# EAGLE design PRE_amp_16_5 (EAGLE 9.0.0)
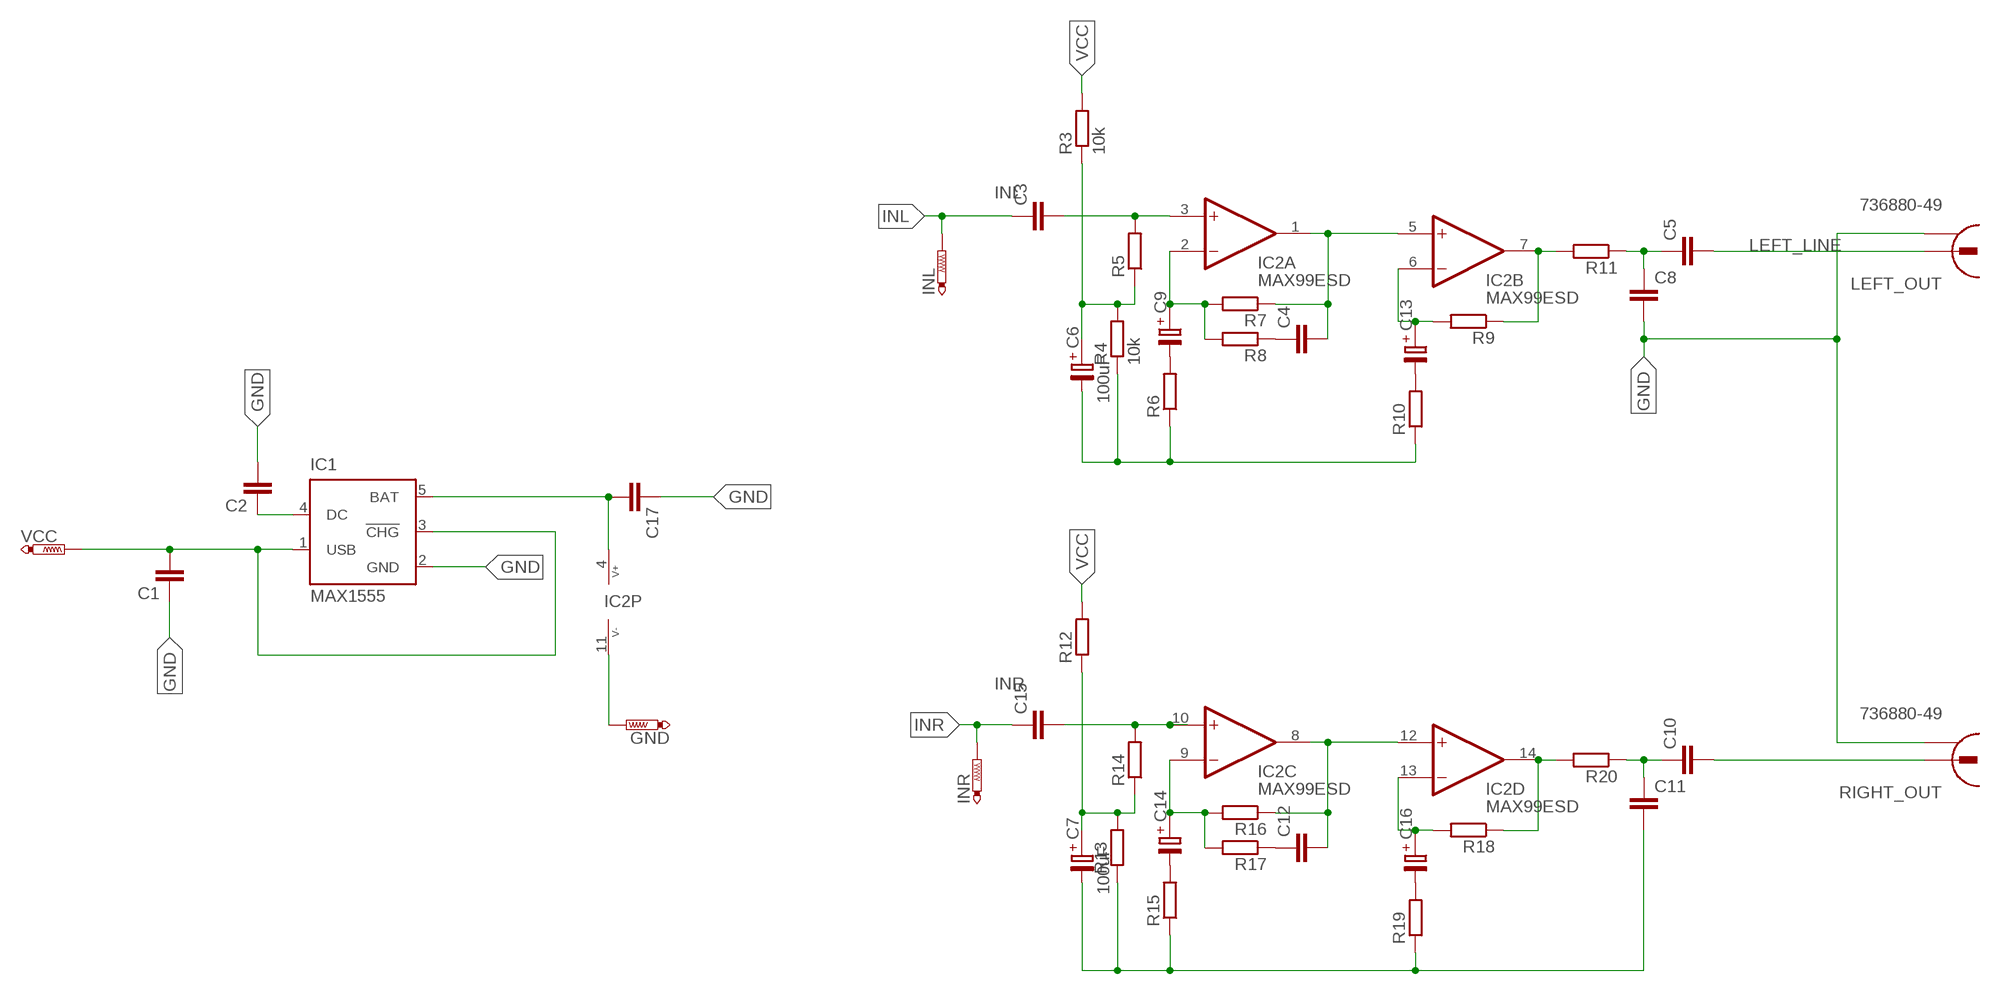
[diagram p0: schematic, sheet 1]

## Parts
C1  C-EUC0805  [C0805]
C2  C-EUC0805  [C0805]
C3  C-EUC0805  [C0805]
C4  C-EUC0805  [C0805]
C5  C-EUC0805  [C0805]
C6  100uF  C-PR-SMD-SV-D  [SV-D]
C7  100uF  C-PR-SMD-SV-D  [SV-D]
C8  C-EUC0805  [C0805]
C9  C-PR-SMD-SV-B  [SV-B]
C10  C-EUC0805  [C0805]
C11  C-EUC0805  [C0805]
C12  C-EUC0805  [C0805]
C13  C-PR-SMD-SV-B  [SV-B]
C14  C-PR-SMD-SV-B  [SV-B]
C15  C-EUC0805  [C0805]
C16  C-PR-SMD-SV-B  [SV-B]
C17  C-EUC0805  [C0805]
GND  PTR1PAD1-13Y  [P1-13Y]
IC1  MAX1555  [SOT23-5L]
IC2  MAX99ESD  [SO14]
INL  PTR1PAD1-13Y  [P1-13Y]
INR  PTR1PAD1-13Y  [P1-13Y]
LEFT_OUT  736880-49  [736880-49]
R3  10k  R-EU_R1206  [R1206]
R4  10k  R-EU_R1206  [R1206]
R5  R-EU_R1206  [R1206]
R6  R-EU_R1206  [R1206]
R7  R-EU_R1206  [R1206]
R8  R-EU_R1206  [R1206]
R9  R-EU_R1206  [R1206]
R10  R-EU_R1206  [R1206]
R11  R-EU_R1206  [R1206]
R12  R-EU_R1206  [R1206]
R13  R-EU_R1206  [R1206]
R14  R-EU_R1206  [R1206]
R15  R-EU_R1206  [R1206]
R16  R-EU_R1206  [R1206]
R17  R-EU_R1206  [R1206]
R18  R-EU_R1206  [R1206]
R19  R-EU_R1206  [R1206]
R20  R-EU_R1206  [R1206]
RIGHT_OUT  736880-49  [736880-49]
VCC  PTR1PAD1-13Y  [P1-13Y]

## Nets
GND: C1.1 C2.2 C6.- C7.- C8.2 C11.2 C17.1 GND.1(TP) IC1.2(GND) IC2.11(P:V-) LEFT_OUT.2 R4.1 R6.1 R10.1 R13.1 R15.1 R19.1 RIGHT_OUT.2
INL: C3.1 INL.1(TP)
INR: C15.1 INR.1(TP)
LEFT_LINE: C5.2 LEFT_OUT.1
N$1: C3.2 IC2.3(A:+IN) R5.2
N$2: C6.+ R3.1 R4.2 R5.1
N$3: C15.2 IC2.10(C:+IN) R14.2
N$4: C7.+ R12.1 R13.2 R14.1
N$5: IC2.7(B:OUT) R9.1 R11.2
N$6: C9.- R6.2
N$7: C4.1 R8.1
N$8: C12.1 R17.1
N$9: C9.+ IC2.2(A:-IN) R7.2 R8.2
N$10: C13.- R10.2
N$11: C5.1 C8.1 R11.1
N$12: C14.- R15.2
N$13: C13.+ IC2.6(B:-IN) R9.2
N$14: C1.2 IC1.1(USB) IC1.3(!CHG) VCC.1(TP)
N$15: C12.2 IC2.8(C:OUT) IC2.12(D:+IN) R16.1
N$16: C14.+ IC2.9(C:-IN) R16.2 R17.2
N$17: C16.- R19.2
N$18: IC2.14(D:OUT) R18.1 R20.2
N$19: C4.2 IC2.1(A:OUT) IC2.5(B:+IN) R7.1
N$20: C16.+ IC2.13(D:-IN) R18.2
N$21: C17.2 IC1.5(BAT) IC2.4(P:V+)
N$22: C2.1 IC1.4(DC)
N$23: C10.2 RIGHT_OUT.1
NS2: C10.1 C11.1 R20.1
VCC: R3.2 R12.2
Unconnected: LEFT_OUT.2@2 RIGHT_OUT.2@2

## Library data of the parts
C1-C5 C8 C10-C12 C15 C17 = rcl:C-EU: CAPACITOR, European symbol
C6 C7 C9 C13 C14 C16 = cap-pan40:C-PR: POLARIZED ELECTROLYTIC/TANTALUM
GND INL INR VCC = testpad:PTR1: TEST PIN
IC1 = maxim:MAX1555: Dual-Input USB/AC Adapter 1-Cell Li+ Battery Chargers Source: http://www.maxim-ic.com .. MAX1551-MAX1555.pdf
IC2 = maxim:MAX99*: Micropower, Low-Voltage Rail-to-Rail I/O Comparators Source: http://pdfserv.maxim-ic.com/en/ds/MAX985-MAX994.pdf
LEFT_OUT RIGHT_OUT = con-conrad:736880-49: Cinch Connector ( RCA Jack )
R3-R20 = rcl:R-EU_: RESISTOR, European symbol

## Board
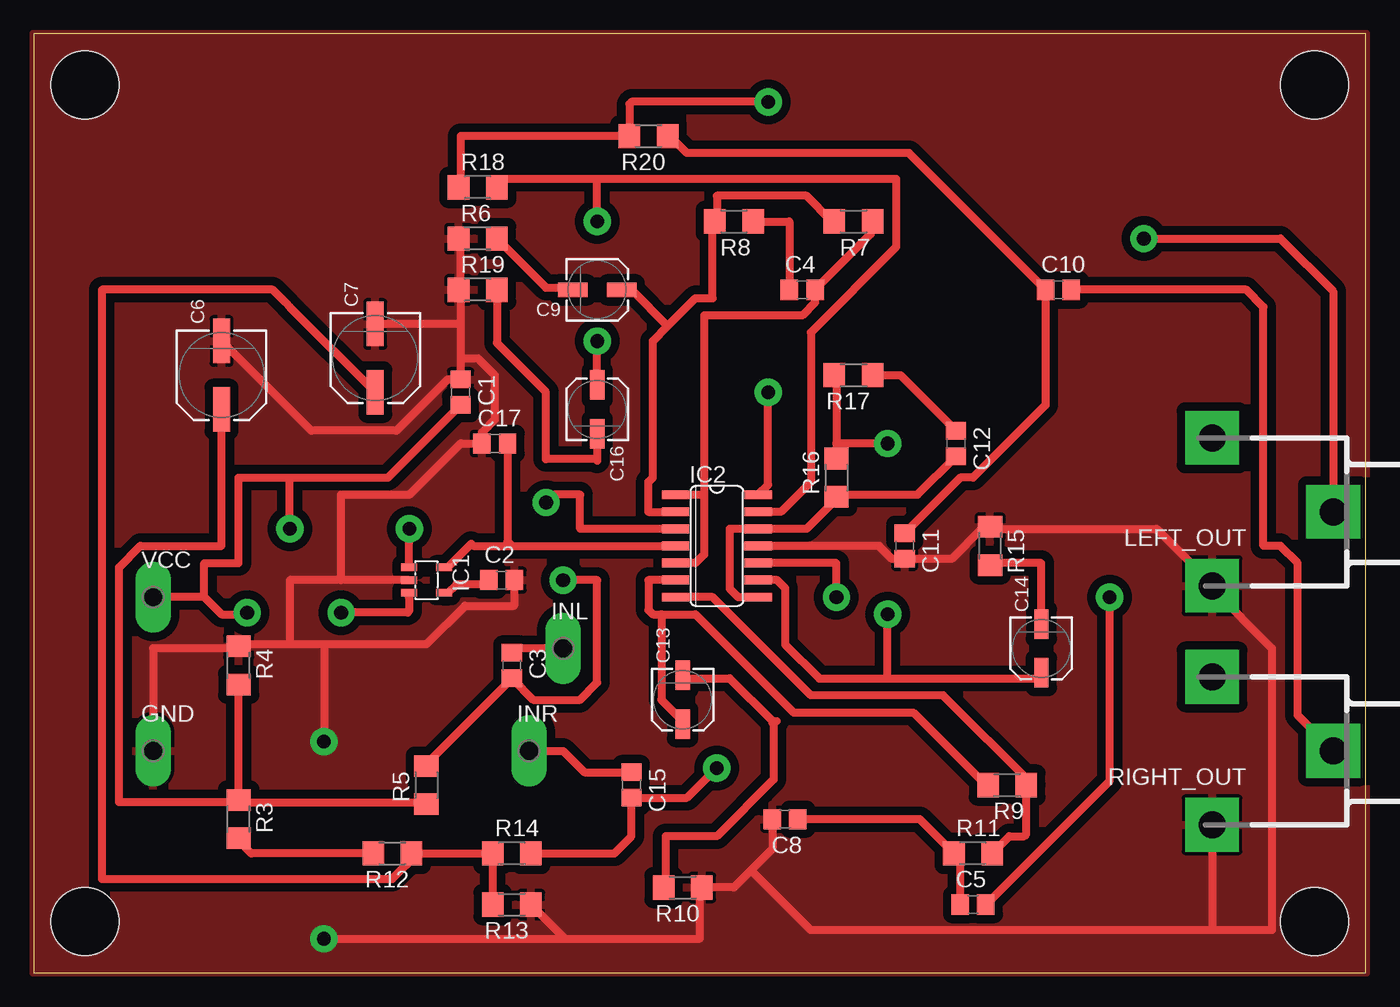
[diagram p1: board, top side]
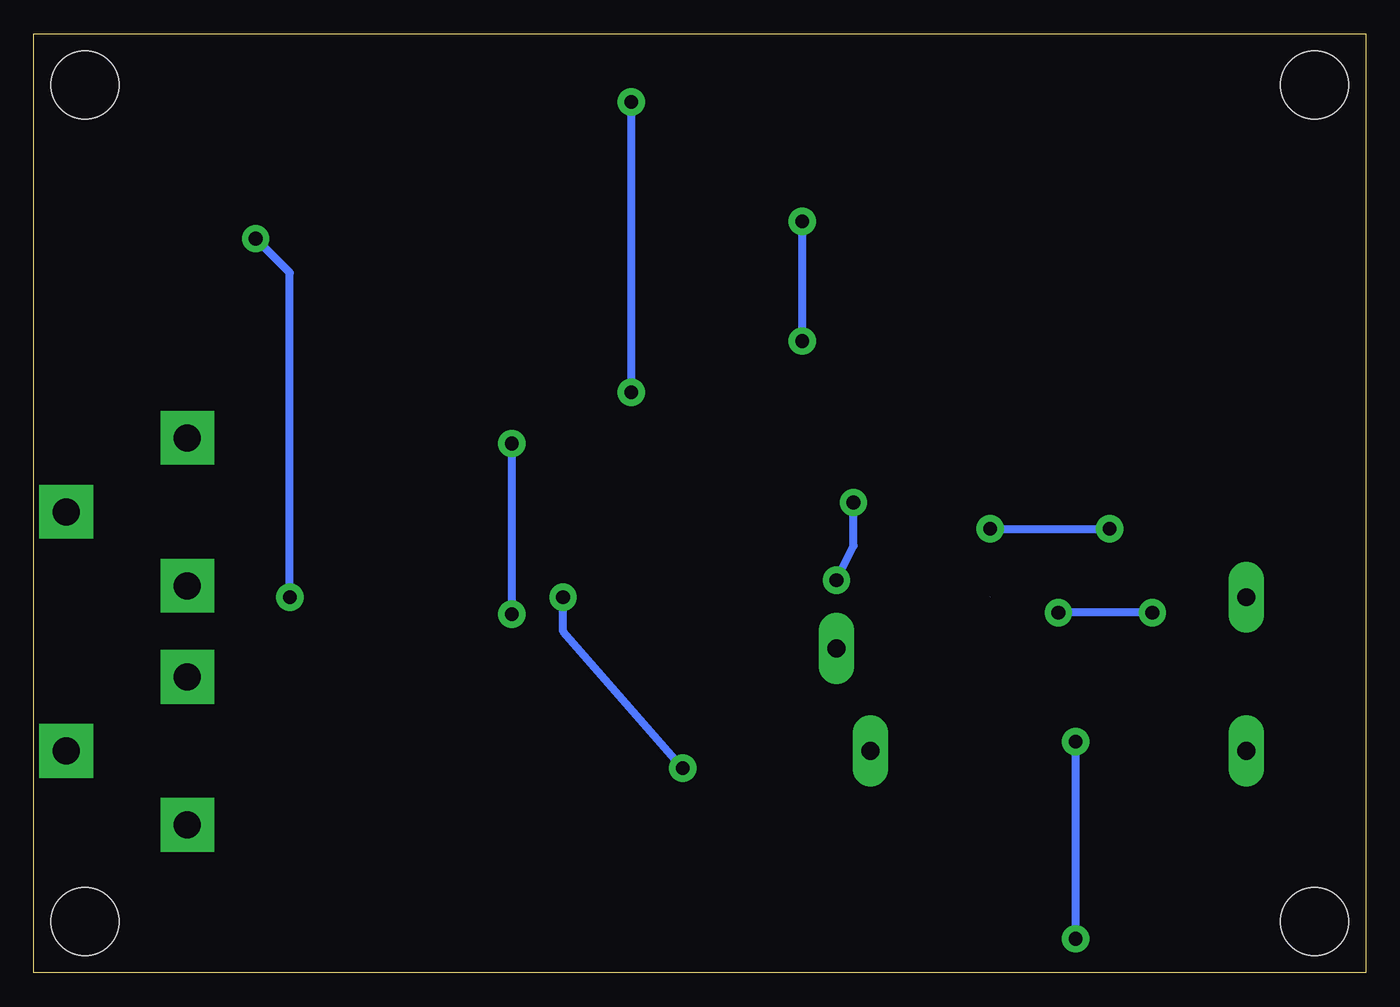
[diagram p2: board, bottom side, seen from below]

Size 99.06 x 69.85 mm. Coordinates in mm from the lower left corner, seen from the top.
Outline: 0,0 99.06,0 99.06,69.85 0,69.84 0,0
Copper layers (1*16): Top 0.035mm / dielectric 1.5mm / Bottom 0.035mm
Design rules "LabE *": minimum track width 24mil, minimum drill 0.8mm, track to track 25mil, track to pad 25mil, pad to pad 25mil, via to via 25mil, smd to smd 25mil, copper to edge 0mil, drill to drill 16mil, minimum pad ring 20mil, minimum via ring 20mil, stop-mask expansion 4mil, vias tented up to drill 0mil, thermal gap 10mil
Holes 5.08 mm at 95.25,66.04 3.81,66.04 3.81,3.81 95.25,3.81

### Footprints (pad centres in the part's own frame; a part is rotated, then mirrored left to right if it is on the bottom)
C0805 = smd 1.3 x 1.5: 1 -0.95,0; 2 0.95,0
SV-D = smd 3.302 x 1.27: + -2.54,0; - 2.54,0
SV-B = smd 2.184 x 1.067: + -1.81,0; - 1.81,0
P1-13Y = drill 1.321 pad 1.905 long: 1 0,0
SOT23-5L = smd 0.55 x 1.2: 1 -0.95,-1.3; 2 0,-1.3; 3 0.95,-1.3; 4 0.95,1.3; 5 -0.95,1.3
SO14 = smd 0.66 x 2.032: 1 -3.81,-3.073; 2 -2.54,-3.073; 3 -1.27,-3.073; 4 0,-3.073; 5 1.27,-3.073; 6 2.54,-3.073; 7 3.81,-3.073; 8 3.81,3.073; 9 2.54,3.073; 10 1.27,3.073; 11 0,3.073; 12 -1.27,3.073; 13 -2.54,3.073; 14 -3.81,3.073
736880-49 = drill 2 pad 3.81 square: 1 -3.92,0; 2 5.08,5.5; 2@2 5.08,-5.5
R1206 = smd 1.6 x 1.803: 1 -1.422,0; 2 1.422,0

### Placement (x,y rotation side)
C1  31.75,43.18 270 top
C2  34.8,29.21 0 top
C3  35.56,22.86 270 top
C4  57.15,50.8 0 top
C5  69.85,5.08 0 top
C6  13.97,44.45 90 top
C7  25.4,45.72 90 top
C8  55.88,11.43 180 top
C9  41.91,50.8 180 top
C10  76.2,50.8 0 top
C11  64.77,31.75 270 top
C12  68.58,39.37 270 top
C13  48.26,20.32 90 top
C14  74.93,24.13 90 top
C15  44.45,13.97 270 top
C16  41.91,41.91 270 top
C17  34.29,39.37 0 top
GND  8.89,16.51 0 top
IC1  29.21,29.21 270 top
IC2  50.8,31.75 270 top
INL  39.37,24.13 0 top
INR  36.83,16.51 0 top
LEFT_OUT  92.71,34.29 180 top
R3  15.24,11.43 270 top
R4  15.24,22.86 270 top
R5  29.21,13.97 90 top
R6  33.02,54.61 0 top
R7  60.96,55.88 180 top
R8  52.07,55.88 180 top
R9  72.39,13.97 180 top
R10  48.26,6.35 180 top
R11  69.85,8.89 0 top
R12  26.67,8.89 180 top
R13  35.56,5.08 180 top
R14  35.56,8.89 0 top
R15  71.12,31.75 270 top
R16  59.69,36.83 90 top
R17  60.96,44.45 180 top
R18  33.02,58.42 0 top
R19  33.02,50.8 0 top
R20  45.72,62.23 180 top
RIGHT_OUT  92.71,16.51 180 top
VCC  8.89,27.94 0 top

### Tracks (layer width: path | path; a pad name or v marks a point on that pad's centre or on a via)
GND  (via drill 1.02)
  Top 0.61: 31.75,50.8 31.75,48.26 | 31.75,48.26 31.75,45.72 | 31.75,45.72 C1.1 | 31.75,50.8 31.75,54.61 R6.1 31.43,54.61 | 31.75,50.8 R19.1 | C6.- 20.64,40.32 26.99,40.32 30.8,44.13 C1.1 | C1.1 | 31.75,48.26 C7.- | 19.05,24.45 15.24,24.45 R4.1 15.24,24.13 8.89,24.13 GND.1 | 19.05,24.45 21.59,24.45 | 21.59,24.45 29.21,24.45 32.07,27.31 35.69,27.31 35.75,27.37 C2.2 | C11.2 68.26,30.8 70.48,33.02 71.12,33.02 | IC2.11 62.86,31.75 63.82,30.8 C11.2 | C11.2 | 71.12,33.02 83.5,33.02 87.63,28.89 LEFT_OUT.2 87.63,28.57 92.08,24.13 92.08,3.18 87.63,3.18 | 71.12,33.02 R15.1 | C8.2 54.93,9.21 53.34,7.62 | 53.34,7.62 52.07,6.35 R10.1 49.53,6.2 49.53,2.54 39.52,2.54 | R13.1 39.52,2.54 | 53.34,7.62 57.78,3.18 87.63,3.18 | RIGHT_OUT.2 87.63,3.18 | v21.59,2.54 39.52,2.54 | 21.59,24.45 v21.59,17.2 | IC1.2 22.86,29.21 | 31.75,45.72 33.02,45.72 34.29,44.45 34.29,41.15 33.34,40.2 C17.1 31.75,39.37 27.94,35.56 22.86,35.56 22.86,29.21 | 22.86,29.21 19.05,29.21 19.05,24.45
  Bottom 0.61: v21.59,17.2 v21.59,2.54
  pour Top: 0,69.85 99.06,69.85 99.06,0 0,0
INL
  Top 0.61: INL.1 35.88,24.13 C3.1
INR
  Top 0.61: 37.15,16.19 INR.1 39.37,16.51 40.96,14.92 C15.1
LEFT_LINE  (via drill 1.02)
  Top 0.61: C5.2 80.01,14.29 v80.01,27.94 | v82.55,54.61 92.71,54.61 96.63,50.69 LEFT_OUT.1
  Bottom 0.61: v80.01,27.94 80.01,52.07 v82.55,54.61
N$1  (via drill 1.02)
  Top 0.61: R5.2 29.21,15.56 C3.2 37.15,20.32 40.64,20.32 41.91,21.59 41.91,29.21 v39.37,29.21 | IC2.3 40.64,33.02 40.64,35.56 38.68,35.56 v38.1,34.98
  Bottom 0.61: v39.37,29.21 38.1,31.75 v38.1,34.98
N$2
  Top 0.61: 15.24,12.7 29.21,12.7 R5.1 | R4.2 R3.1 15.24,12.7 | C6.+ 13.97,31.75 7.94,31.75 6.35,30.16 6.35,12.7 15.24,12.7
N$3  (via drill 1.02)
  Top 0.61: 36.83,9.04 R14.2 43.18,8.89 44.45,10.16 C15.2 48.58,13.02 v50.8,15.24 | v59.69,27.94 59.69,30.48 IC2.10
  Bottom 0.61: v50.8,15.24 59.69,25.4 v59.69,27.94
N$4
  Top 0.61: R12.1 28.57,8.89 26.67,6.98 5.08,6.98 5.08,50.8 17.78,50.8 18.73,49.85 19.05,49.53 C7.+ | 28.26,8.89 R12.1 | R13.2 R14.1 R12.1
N$5
  Top 0.61: R9.1 74.3,13.97 67.63,20.64 57.78,20.64 50.48,27.94 IC2.7 | 73.98,13.97 R9.1 | R11.2 72.54,10.16 73.66,10.16 73.81,10.31 R9.1
N$6
  Top 0.61: 34.61,54.61 R6.2 38.1,50.95 39.95,50.95 C9.-
N$7
  Top 0.61: R8.1 56.2,55.88 C4.1
N$8
  Top 0.61: R17.1 64.45,44.45 C12.1
N$9
  Top 0.61: R7.2 59.37,55.88 57.47,57.78 50.8,57.78 50.8,55.88 R8.2 50.48,55.88 50.48,50.17 49.21,50.17 47.15,48.1 | IC2.2 45.72,34.29 45.72,36.51 46.04,36.83 46.04,46.99 47.15,48.1 | C9.+ 44.45,50.8 47.15,48.1
N$10
  Top 0.61: 54.93,18.73 55.24,18.73 | 54.93,18.73 51.75,21.91 48.26,21.91 C13.- | 54.93,18.73 54.93,18.6 55.03,18.5 55.03,14.39 50.8,10.16 46.99,10.16 46.99,6.5 R10.2
N$11
  Top 0.61: C5.1 68.9,8.42 R11.1 65.89,11.43 C8.1
N$12
  Top 0.61: C14.- 74.93,30.48 71.27,30.48 R15.2
N$13
  Top 0.61: 46.67,26.67 46.04,26.67 45.72,26.99 45.72,29.21 IC2.6 | 46.67,26.67 49.21,26.67 56.52,19.37 65.41,19.37 70.8,13.97 R9.2 | 46.67,26.67 46.67,20.32 48.26,18.73 C13.+
N$14  (via drill 1.02)  (1 unrouted)
  Top 0.61: C1.2 26.35,36.83 19.05,36.83 | 12.7,27.94 13.97,26.67 15.37,26.67 15.49,26.8 v15.88,26.8 | 12.7,27.94 VCC.1 | 12.7,27.94 12.7,30.48 15.24,30.48 15.24,36.83 19.05,36.83 | v19.05,33.02 19.05,36.83 | IC1.1 27.91,32.99 v27.94,33.02 | 27.94,27.94 27.91,27.96 | v22.86,26.8 27.81,26.8 27.91,26.89 27.91,27.94 IC1.3
  Bottom 0.61: v27.94,33.02 v19.05,33.02 | v15.88,26.8 v22.86,26.8
N$15
  Top 0.61: IC2.8 52.39,27.94 51.75,28.57 51.75,33.02 IC2.12 57.47,33.02 59.69,35.24 R16.1 59.69,35.56 65.72,35.56 C12.2
N$16  (via drill 1.02)
  Top 0.61: 59.69,39.37 59.69,44.45 R17.2 | 59.69,39.37 R16.2 | IC2.9 55.28,29.21 55.88,28.61 55.88,24.42 58.42,21.88 63.5,21.88 | C14.+ 74.49,21.88 63.5,21.88 | 63.5,21.88 v63.5,26.67 | v63.5,39.37 59.69,39.37
  Bottom 0.61: v63.5,26.67 v63.5,39.37
N$17
  Top 0.61: R19.2 34.44,46.84 38.1,43.18 38.1,38.2 41.81,38.2 41.91,38.1 C16.-
N$18  (via drill 1.02)
  Top 0.61: R18.1 31.75,58.42 31.75,62.23 R20.2 44.3,64.62 44.45,64.77 v54.61,64.77 | IC2.14 54.61,36.3 v54.61,43.18
  Bottom 0.61: v54.61,43.18 v54.61,64.77
N$19
  Top 0.61: IC2.5 49.21,30.48 49.85,31.11 49.85,35.56 | IC2.1 49.85,35.56 | C4.2 62.23,54.93 62.23,55.88 R7.1 | 49.85,35.56 49.85,48.89 57.15,48.89 58.1,49.85 C4.2 | C4.2
N$20  (via drill 1.02)
  Top 0.61: IC2.13 55.56,34.29 57.78,36.51 57.78,47.62 64.14,53.98 64.14,59.06 41.91,59.06 | C16.+ v41.91,46.99 | R18.2 35.08,59.06 41.91,59.06 | v41.91,55.88 41.91,59.06
  Bottom 0.61: v41.91,46.99 v41.91,55.88
N$21
  Top 0.61: IC1.5 30.8,30.16 32.54,31.91 32.7,31.75 35.56,31.75 | 35.56,31.75 IC2.4 | C17.2 35.24,32.07 35.56,31.75
N$22
  Top 0.61: IC1.4 30.8,28.26 31.43,28.89 33.53,28.89 C2.1
N$23
  Top 0.61: RIGHT_OUT.1 93.98,19.16 93.98,30.48 92.71,31.75 91.44,31.75 91.44,49.53 90.17,50.8 C10.2
NS2
  Top 0.61: C10.1 75.25,42.23 69.85,36.83 68.9,36.83 C11.1 | C10.1 65.09,60.96 48.58,60.96 47.31,62.23 R20.1 | C10.1
VCC
  Top 0.61: R12.2 16.19,8.89 15.24,9.84 R3.2